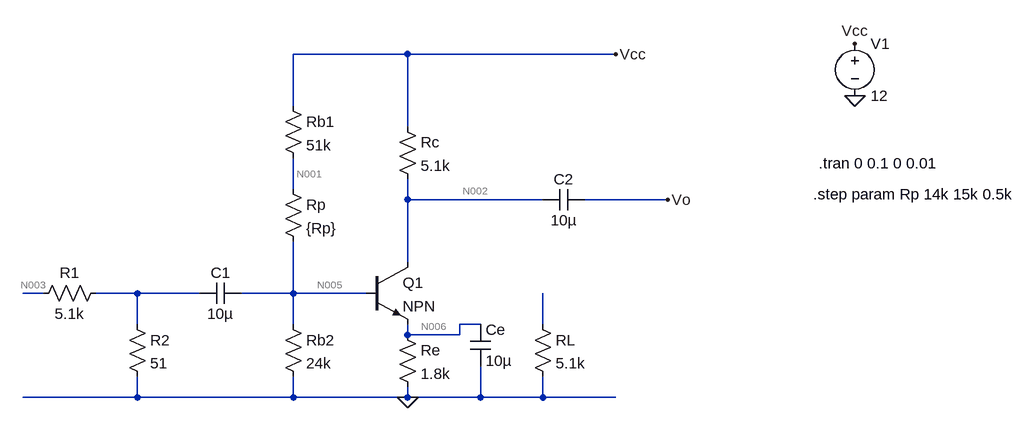
[diagram p0: schematic Experiment2_1_1.asc]
Experiment2_1_1.asc, the LTspice schematic file:
Version 4.1
SHEET 1 1592 680
WIRE 592 -256 416 -256
WIRE 912 -256 592 -256
WIRE 416 -176 416 -256
WIRE 592 -144 592 -256
WIRE 416 -48 416 -96
WIRE 592 -32 592 -64
WIRE 800 -32 592 -32
WIRE 992 -32 864 -32
WIRE 592 64 592 -32
WIRE 32 112 0 112
WIRE 176 112 112 112
WIRE 272 112 176 112
WIRE 416 112 416 32
WIRE 416 112 336 112
WIRE 528 112 416 112
WIRE 176 160 176 112
WIRE 416 160 416 112
WIRE 704 160 672 160
WIRE 800 160 800 112
WIRE 592 176 592 160
WIRE 672 176 672 160
WIRE 672 176 592 176
WIRE 176 272 176 240
WIRE 176 272 0 272
WIRE 416 272 416 240
WIRE 416 272 176 272
WIRE 592 272 592 256
WIRE 592 272 416 272
WIRE 704 272 704 224
WIRE 704 272 592 272
WIRE 800 272 800 240
WIRE 800 272 704 272
WIRE 912 272 800 272
FLAG 592 272 0
FLAG 912 -256 Vcc
FLAG 1280 -272 Vcc
FLAG 1280 -192 0
FLAG 992 -32 Vo
SYMBOL res 128 96 R90
WINDOW 0 0 56 VBottom 2
WINDOW 3 32 56 VTop 2
SYMATTR InstName R1
SYMATTR Value 5.1k
SYMBOL res 160 144 R0
SYMATTR InstName R2
SYMATTR Value 51
SYMBOL res 400 144 R0
SYMATTR InstName Rb2
SYMATTR Value 24k
SYMBOL res 400 -64 R0
SYMATTR InstName Rp
SYMATTR Value {Rp}
SYMBOL res 400 -192 R0
SYMATTR InstName Rb1
SYMATTR Value 51k
SYMBOL npn 528 64 R0
SYMATTR InstName Q1
SYMBOL res 576 160 R0
SYMATTR InstName Re
SYMATTR Value 1.8k
SYMBOL res 784 144 R0
SYMATTR InstName RL
SYMATTR Value 5.1k
SYMBOL res 576 -160 R0
SYMATTR InstName Rc
SYMATTR Value 5.1k
SYMBOL voltage 1280 -288 R0
WINDOW 123 0 0 Left 0
WINDOW 39 0 0 Left 0
SYMATTR InstName V1
SYMATTR Value 12
SYMBOL cap 336 96 R90
WINDOW 0 0 32 VBottom 2
WINDOW 3 32 32 VTop 2
SYMATTR InstName C1
SYMATTR Value 10µ
SYMATTR SpiceLine V=6.3 Irms=0 Rser=4 Lser=0 mfg="AVX" pn="TAJA106M006" type="Tantalum"
SYMBOL cap 800 -16 R270
WINDOW 0 32 32 VTop 2
WINDOW 3 0 32 VBottom 2
SYMATTR InstName C2
SYMATTR Value 10µ
SYMATTR SpiceLine V=6.3 Irms=0 Rser=4 Lser=0 mfg="AVX" pn="TAJA106M006" type="Tantalum"
SYMBOL cap 688 160 R0
SYMATTR Value 10µ
SYMATTR InstName Ce
SYMATTR SpiceLine V=6.3 Irms=0 Rser=4 Lser=0 mfg="AVX" pn="TAJA106M006" type="Tantalum"
TEXT 1224 -88 Left 2 !.tran 0 0.1 0 0.01
TEXT 1216 -40 Left 2 !.step param Rp 14k 15k 0.5k

The netlist it stands for:
* Experiment2_1_1.asc
R1 N004 N003 5.1k
R2 N004 0 51
Rb2 N005 0 24k
Rp N001 N005 {Rp}
Rb1 Vcc N001 51k
Q1 N002 N005 N006 0 NPN
Re N006 0 1.8k
RL N007 0 5.1k
Rc Vcc N002 5.1k
V1 Vcc 0 12
C1 N005 N004 10µ V=6.3 Irms=0 Rser=4 Lser=0 mfg="AVX" pn="TAJA106M006" type="Tantalum"
C2 N002 Vo 10µ V=6.3 Irms=0 Rser=4 Lser=0 mfg="AVX" pn="TAJA106M006" type="Tantalum"
Ce N006 0 10µ V=6.3 Irms=0 Rser=4 Lser=0 mfg="AVX" pn="TAJA106M006" type="Tantalum"
.model NPN NPN
.model PNP PNP
.lib standard.bjt
.tran 0 0.1 0 0.01
.step param Rp 14k 15k 0.5k
.backanno
.end

* Results of the author's LTspice run, read from the files saved beside the schematic
* Operating Point (first step), zero values left out:
*   V(n001) = 4.954 V
*   V(vcc) = 12 V
*   V(n006) = 2.24 V
*   V(n005) = 3.02 V
*   V(n002) = 5.715 V
*   V(vo) = 5.715 V
*   Ic(Q1) = 1.232 mA
*   Ib(Q1) = 12.32 µA
*   Ie(Q1) = -1.245 mA
*   I(Rb2) = 125.8 µA
*   I(Rb1) = 138.2 µA
*   I(Re) = 1.245 mA
*   I(V1) = -1.37 mA
*   I(Rp) = 138.2 µA
*   I(Rc) = 1.232 mA
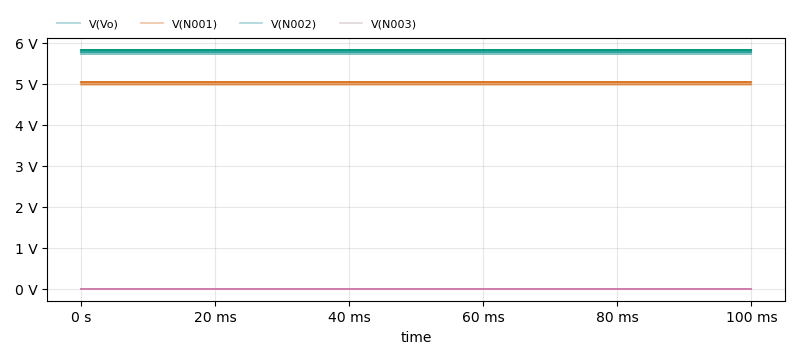
[diagram p1: Transient Analysis of Experiment2_1_1.asc, plotted from the saved traces]
* Transient Analysis, 3 runs:
*   V(Vo) [rp=14000]: min 5.715 V, max 5.715 V, average 5.715 V, rms 5.715 V, last 5.715 V
*   V(Vo) [rp=14500]: min 5.762 V, max 5.762 V, average 5.762 V, rms 5.762 V, last 5.762 V
*   V(Vo) [rp=15000]: min 5.809 V, max 5.809 V, average 5.809 V, rms 5.809 V, last 5.809 V
*   V(N001) [rp=14000]: min 4.954 V, max 4.954 V, average 4.954 V, rms 4.954 V, last 4.954 V
*   V(N001) [rp=14500]: min 4.995 V, max 4.995 V, average 4.995 V, rms 4.995 V, last 4.995 V
*   V(N001) [rp=15000]: min 5.035 V, max 5.035 V, average 5.035 V, rms 5.035 V, last 5.035 V
*   V(N002) [rp=14000]: min 5.715 V, max 5.715 V, average 5.715 V, rms 5.715 V, last 5.715 V
*   V(N002) [rp=14500]: min 5.762 V, max 5.762 V, average 5.762 V, rms 5.762 V, last 5.762 V
*   V(N002) [rp=15000]: min 5.809 V, max 5.809 V, average 5.809 V, rms 5.809 V, last 5.809 V
*   V(N003) [rp=14000]: min 1.54 fV, max 1.554 fV, average 1.547 fV, rms 1.547 fV, last 1.554 fV
*   V(N003) [rp=14500]: min 1.532 fV, max 1.776 fV, average 1.654 fV, rms 1.658 fV, last 1.776 fV
*   V(N003) [rp=15000]: min 1.523 fV, max 1.554 fV, average 1.539 fV, rms 1.539 fV, last 1.554 fV